# Altium schematic sheet MCU.SchDoc
size Tabloid; SheetNumber: 3; SheetTotal: 3
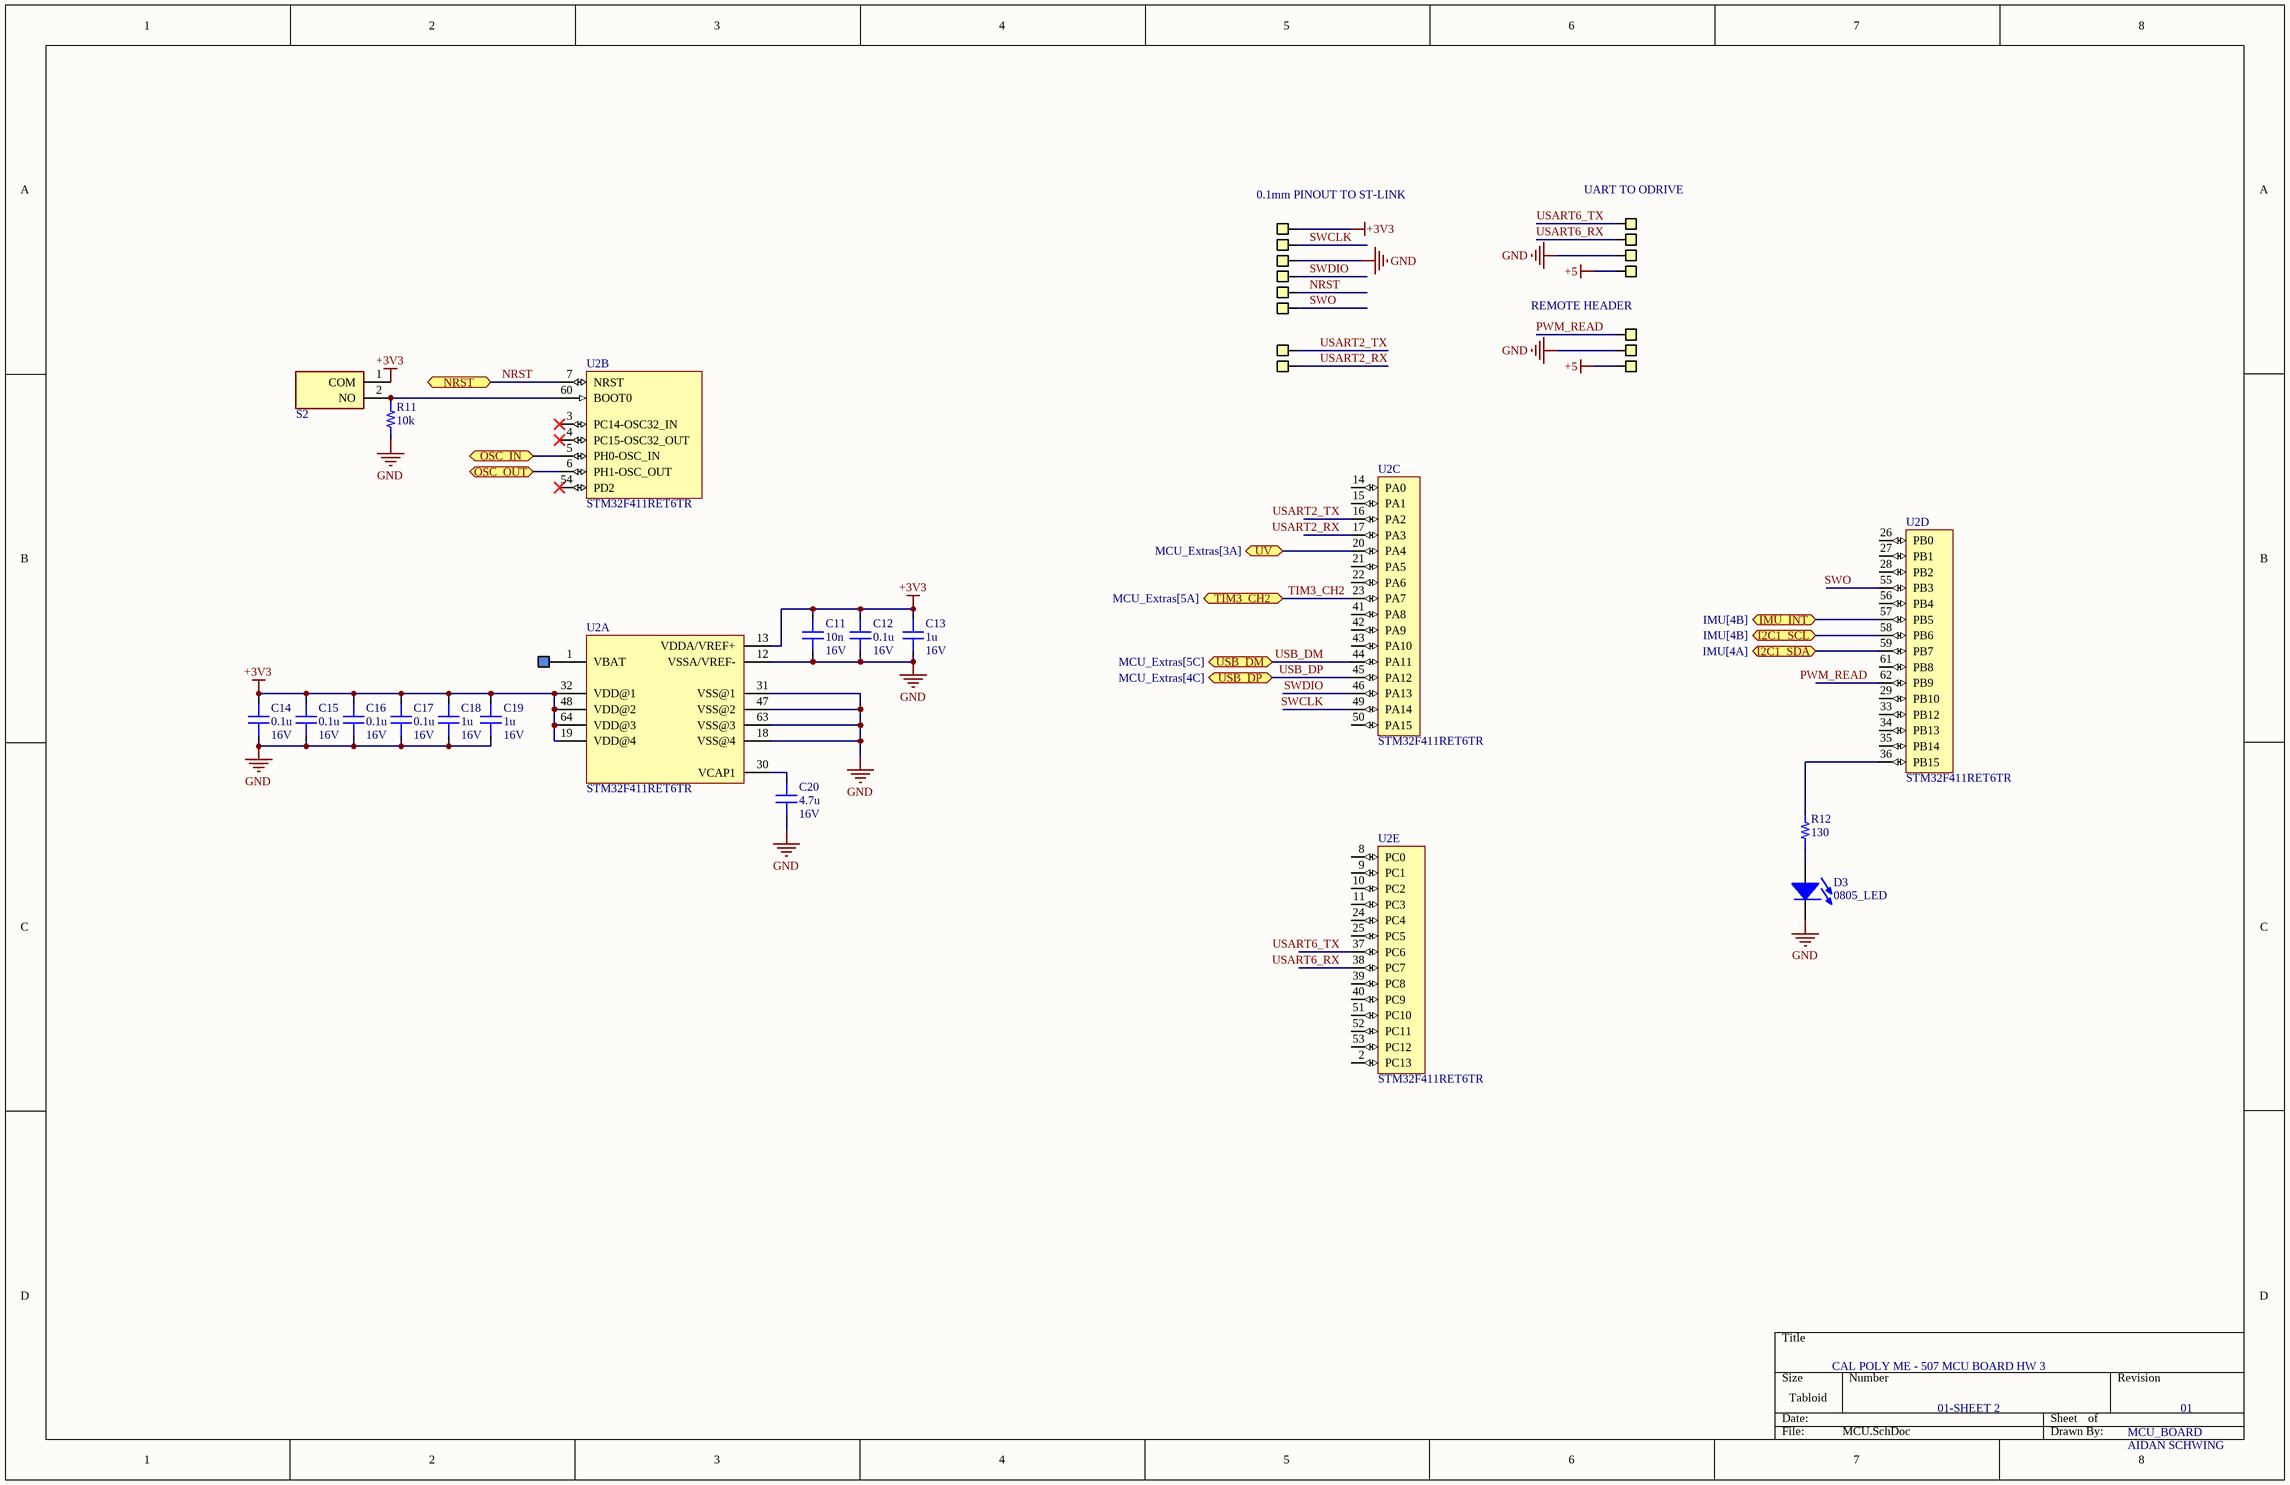
[diagram p0: MCU.SchDoc]

## Parts
C11  value 10n  Voltage: 16V  [0805_CAP]  (hidden comment: Capacitor)
C12  value 0.1u  Voltage: 16V  [0805_CAP]  (hidden comment: Capacitor)
C13  value 1u  Voltage: 16V  [0805_CAP]  (hidden comment: Capacitor)
C14  value 0.1u  Voltage: 16V  [0805_CAP]  (hidden comment: Capacitor)
C15  value 0.1u  Voltage: 16V  [0805_CAP]  (hidden comment: Capacitor)
C16  value 0.1u  Voltage: 16V  [0805_CAP]  (hidden comment: Capacitor)
C17  value 0.1u  Voltage: 16V  [0805_CAP]  (hidden comment: Capacitor)
C18  value 1u  Voltage: 16V  [0805_CAP]  (hidden comment: Capacitor)
C19  value 1u  Voltage: 16V  [0805_CAP]  (hidden comment: Capacitor)
C20  value 4.7u  Voltage: 16V  [0805_CAP]  (hidden comment: Capacitor)
D3  0805_LED  [0805_LED]
R11  value 10k  [0603_RES]  (hidden comment: Resistor)
R12  value 130  [0603_RES]  (hidden comment: Resistor)
S2  DS04-254-2-01BK-SMT-TR  [DS04254201BKSMTTR]  (value not drawn)
U2  STM32F411RET6TR  [QFP50P1200X1200X160-64N]  (parts A,B,C,D,E of 5)
X6  GenericPinHeader(0.1in)  [GenericPinHeader(.1in)]  (value not drawn)
X7  GenericPinHeader(0.1in)  [GenericPinHeader(.1in)]  (value not drawn)
X8  GenericPinHeader(0.1in)  [GenericPinHeader(.1in)]  (value not drawn)
X9  GenericPinHeader(0.1in)  [GenericPinHeader(.1in)]  (value not drawn)
X10  GenericPinHeader(0.1in)  [GenericPinHeader(.1in)]  (value not drawn)
X12  GenericPinHeader(0.1in)  [GenericPinHeader(.1in)]  (value not drawn)
X13  GenericPinHeader(0.1in)  [GenericPinHeader(.1in)]  (value not drawn)
X14  GenericPinHeader(0.1in)  [GenericPinHeader(.1in)]  (value not drawn)
X15  GenericPinHeader(0.1in)  [GenericPinHeader(.1in)]  (value not drawn)
X16  GenericPinHeader(0.1in)  [GenericPinHeader(.1in)]  (value not drawn)
X17  HeaderPad  [HeaderPad]  (value not drawn)
X18  GenericPinHeader(0.1in)  [GenericPinHeader(.1in)]  (value not drawn)
X20  GenericPinHeader(0.1in)  [GenericPinHeader(.1in)]  (value not drawn)
X21  GenericPinHeader(0.1in)  [GenericPinHeader(.1in)]  (value not drawn)
X24  GenericPinHeader(0.1in)  [GenericPinHeader(.1in)]  (value not drawn)
X25  GenericPinHeader(0.1in)  [GenericPinHeader(.1in)]  (value not drawn)

## Ports
I2C1_SCL (bidir, see IMU[4B]), I2C1_SDA (bidir, see IMU[4A]), IMU_INT (bidir, see IMU[4B]), NRST (bidir, see MCU_Extras[1C]), OSC_IN (bidir, see MCU_Extras[2D]), OSC_OUT (bidir, see MCU_Extras[2D]), TIM3_CH2 (bidir, see MCU_Extras[5A]), USB_DM (bidir, see MCU_Extras[5C]), USB_DP (bidir, see MCU_Extras[4C]), ~{UV} (bidir, see MCU_Extras[3A])

## Nets
+3V3: C11.1 C12.1 C13.1 C14.1 C15.1 C16.1 C17.1 C18.1 C19.1 S2.1(COM) U2.13(VDDA/VREF+) U2.19(VDD@4) U2.32(VDD@1) U2.48(VDD@2) U2.64(VDD@3) X7.1(Pin)
+5: X21.1(Pin) X25.1(Pin)
GND: C11.2 C12.2 C13.2 C14.2 C15.2 C16.2 C17.2 C18.2 C19.2 C20.2 D3.2(K) R11.1 U2.12(VSSA/VREF-) U2.18(VSS@4) U2.31(VSS@1) U2.47(VSS@2) U2.63(VSS@3) X10.1(Pin) X20.1(Pin) X24.1(Pin)
I2C1_SCL: U2.58(PB6) ; port I2C1_SCL
I2C1_SDA: U2.59(PB7) ; port I2C1_SDA
IMU_INT: U2.57(PB5) ; port IMU_INT
NRST: U2.7(NRST) X13.1(Pin) ; port NRST
OSC_IN: U2.5(PH0-OSC_IN) ; port OSC_IN
OSC_OUT: U2.6(PH1-OSC_OUT) ; port OSC_OUT
PWM_READ: U2.62(PB9) X18.1(Pin)
SWCLK: U2.49(PA14) X8.1(Pin)
SWDIO: U2.46(PA13) X12.1(Pin)
SWO: U2.55(PB3) X14.1(Pin)
TIM3_CH2: U2.23(PA7) ; port TIM3_CH2
~{UV}: U2.20(PA4) ; port ~{UV}
USART2_RX: U2.17(PA3) X16.1(Pin)
USART2_TX: U2.16(PA2) X15.1(Pin)
USART6_RX: U2.38(PC7) X9.1(Pin)
USART6_TX: U2.37(PC6) X6.1(Pin)
USB_DM: U2.44(PA11) ; port USB_DM
USB_DP: U2.45(PA12) ; port USB_DP
NetC20_1: C20.1 U2.30(VCAP1)
NetD3_1: D3.1(A) R12.1
NetR11_2: R11.2 S2.2(NO) U2.60(BOOT0)
NetR12_2: R12.2 U2.36(PB15)
NetU2_1: U2.1(VBAT) X17.1(Pin)

Not connected (* = marked no-connect by the designer): U2 2(PC13) 3(PC14-OSC32_IN)* 4(PC15-OSC32_OUT)* 8(PC0) 9(PC1) 10(PC2) 11(PC3) 14(PA0) 15(PA1) 21(PA5) 22(PA6) 24(PC4) 25(PC5) 26(PB0) 27(PB1) 28(PB2) 29(PB10) 33(PB12) 34(PB13) 35(PB14) 39(PC8) 40(PC9) 41(PA8) 42(PA9) 43(PA10) 50(PA15) 51(PC10) 52(PC11) 53(PC12) 54(PD2)* 56(PB4) 61(PB8)

## Notes on the sheet
- 0.1mm PINOUT TO ST-LINK
- UART TO ODRIVE
- REMOTE HEADER
- CAL POLY ME - 507 MCU BOARD HW 3
- 01-SHEET 2
- MCU_BOARD
- 01
- AIDAN SCHWING

## Library data of the parts
D3 = 0805_LED: Generic 0805 LED
S2 = DS04-254-2-01BK-SMT-TR: DIP Switches / SIP Switches DIP Switch, SPST, 2.54 pitch, flat actuator, SMT, Tape and reel, 1 position, Black; Manufacturer_Name: CUI Devices; Datasheet Link: https://www.cuidevices.com/product/resource/supplyframepdf/ds04-254-smt.pdf; Height: 4.3mm; Manufacturer_Part_Number: DS04-254-2-01BK-SMT-TR; Mouser Part Number: 490-DS04254201BK-STR; Mouser Price/Stock: https://www.mouser.co.uk/ProductDetail/CUI-Devices/DS04-254-2-01BK-SMT-TR?qs=wnTfsH77Xs4xXRFXKF0ssg%3D%3D; Arrow Part Number: DS04-254-2-01BK-SMT-TR; Arrow Price/Stock: https://www.arrow.com/en/products/ds04-254-2-01bk-smt-tr/cui-devices?region=nac
U2 = STM32F411RET6TR: High-performance access line, ARM Cortex-M4 core with DSP and FPU, 512 Kbytes Flash, 100 MHz CPU, ART Accelerator; MF: {'manufacturer': u'STMicroelectronics'}; Package: None; Price: None; Value: *; MP: STM32F411RET6TR; Availability: Unavailable
X6-X10 X12-X16 X18 X20 X21 X24 X25 = GenericPinHeader(0.1in): Generic .1in(2.54mm) pitch pin header
X17 = HeaderPad: Pad for pin header
C11-C20 = Capacitor: Dielectric: *; Percent Tolerance: *; ESR: *
R11 R12 = Resistor: Tolerance: *